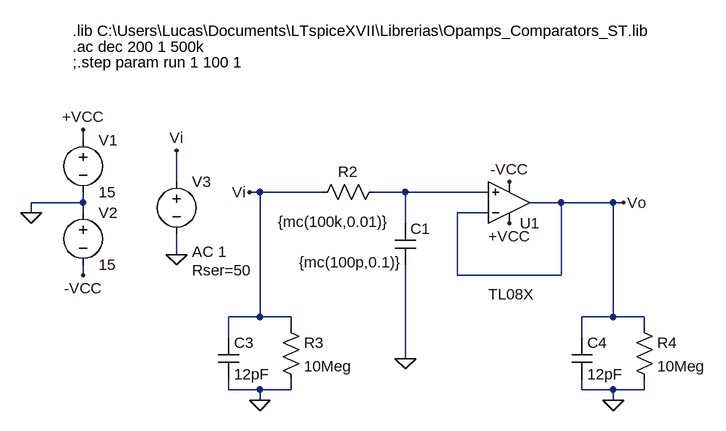
[diagram p0: schematic PrimeraEtapa.asc]
PrimeraEtapa.asc, the LTspice schematic file:
Version 4
SHEET 1 880 680
WIRE -112 0 -112 -16
WIRE 32 64 32 16
WIRE 160 80 144 80
WIRE 256 80 160 80
WIRE 384 80 336 80
WIRE 512 80 384 80
WIRE -112 96 -112 80
WIRE -112 96 -192 96
WIRE 624 96 576 96
WIRE 704 96 624 96
WIRE 720 96 704 96
WIRE -192 112 -192 96
WIRE -112 112 -112 96
WIRE 512 112 464 112
WIRE 384 128 384 80
WIRE 32 176 32 144
WIRE -112 208 -112 192
WIRE 464 208 464 112
WIRE 624 208 624 96
WIRE 624 208 464 208
WIRE 160 272 160 80
WIRE 160 272 112 272
WIRE 208 272 160 272
WIRE 704 272 704 96
WIRE 704 272 656 272
WIRE 752 272 704 272
WIRE 208 288 208 272
WIRE 752 288 752 272
WIRE 112 304 112 272
WIRE 656 304 656 272
WIRE 384 336 384 192
WIRE 112 384 112 368
WIRE 160 384 112 384
WIRE 208 384 208 368
WIRE 208 384 160 384
WIRE 656 384 656 368
WIRE 704 384 656 384
WIRE 752 384 752 368
WIRE 752 384 704 384
WIRE 160 400 160 384
WIRE 704 400 704 384
FLAG -192 112 0
FLAG -112 -16 +VCC
FLAG -112 208 -VCC
FLAG 32 176 0
FLAG 32 16 Vi
FLAG 544 128 +VCC
FLAG 544 64 -VCC
FLAG 384 336 0
FLAG 720 96 Vo
FLAG 144 80 Vi
FLAG 160 400 0
FLAG 704 400 0
SYMBOL Opamps\\opamp2 544 160 M180
WINDOW 3 -32 -77 Left 2
SYMATTR Value TL08X
SYMATTR InstName U1
SYMBOL voltage -112 -16 R0
WINDOW 123 0 0 Left 0
WINDOW 39 0 0 Left 0
SYMATTR InstName V1
SYMATTR Value 15
SYMBOL voltage -112 96 R0
WINDOW 123 0 0 Left 0
WINDOW 39 0 0 Left 0
SYMATTR InstName V2
SYMATTR Value 15
SYMBOL voltage 32 48 R0
WINDOW 123 24 124 Left 2
WINDOW 39 24 152 Left 2
SYMATTR Value2 AC 1
SYMATTR SpiceLine Rser=50
SYMATTR InstName V3
SYMATTR Value ""
SYMBOL res 352 64 R90
WINDOW 0 0 56 VBottom 2
WINDOW 3 46 78 VTop 2
SYMATTR InstName R2
SYMATTR Value {mc(100k,0.01)}
SYMBOL cap 368 128 R0
WINDOW 3 -148 60 Left 2
SYMATTR Value {mc(100p,0.1)}
SYMATTR InstName C1
SYMBOL cap 96 304 R0
SYMATTR InstName C3
SYMATTR Value 12pF
SYMBOL res 192 272 R0
SYMATTR InstName R3
SYMATTR Value 10Meg
SYMBOL cap 640 304 R0
SYMATTR InstName C4
SYMATTR Value 12pF
SYMBOL res 736 272 R0
SYMATTR InstName R4
SYMATTR Value 10Meg
TEXT -128 -168 Left 2 !.lib C:\\Users\\Lucas\\Documents\\LTspiceXVII\\Librerias\\Opamps_Comparators_ST.lib
TEXT -128 -144 Left 2 !.ac dec 200 1 500k
TEXT -128 -120 Left 2 !;.step param run 1 100 1

The netlist it stands for:
* PrimeraEtapa.asc
XU1 N001 Vo +VCC -VCC Vo TL08X  ; pins In+ In- V+ V- OUT
V1 +VCC 0 15
V2 0 -VCC 15
V3 Vi 0 AC 1 Rser=50
R2 N001 Vi {mc(100k,0.01)}
C1 N001 0 {mc(100p,0.1)}
C3 Vi 0 12pF
R3 Vi 0 10Meg
C4 Vo 0 12pF
R4 Vo 0 10Meg
.lib C:\Users\Lucas\Documents\LTspiceXVII\Librerias\Opamps_Comparators_ST.lib
.ac dec 200 1 500k
;.step param run 1 100 1
.backanno
.end

* Results of the author's LTspice run, read from the files saved beside the schematic
* Operating Point, zero values left out:
*   V(-vcc) = -15 V
*   V(+vcc) = 15 V
*   I(V2) = -1.416 mA
*   I(V1) = -1.416 mA
*   Ix(u1:4) = 1.416 mA
*   Ix(u1:5) = -1.416 mA
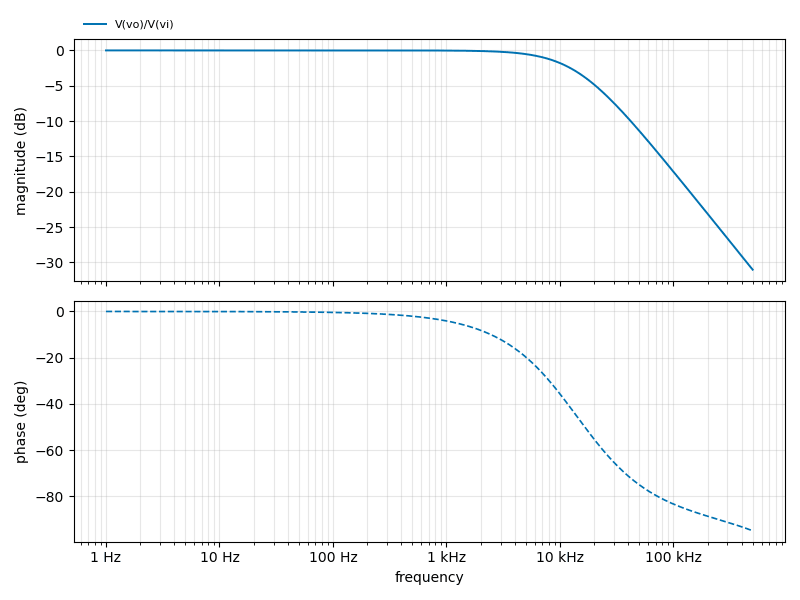
[diagram p1: AC Analysis of PrimeraEtapa.asc, plotted from the saved traces]
* AC Analysis, 1 run:
*   V(vo)/V(vi): -0.00 dB at 1 Hz, -31.03 dB at 500 kHz, peak -0.00 dB at 1 Hz, 3 dB below the peak at 14.02 kHz